# EasyEDA schematic Linkee.json
TITLE: Sheet_1; REV: 1.0; Date: 2023-06-07; Sheet: 1/1; Company: Your Company
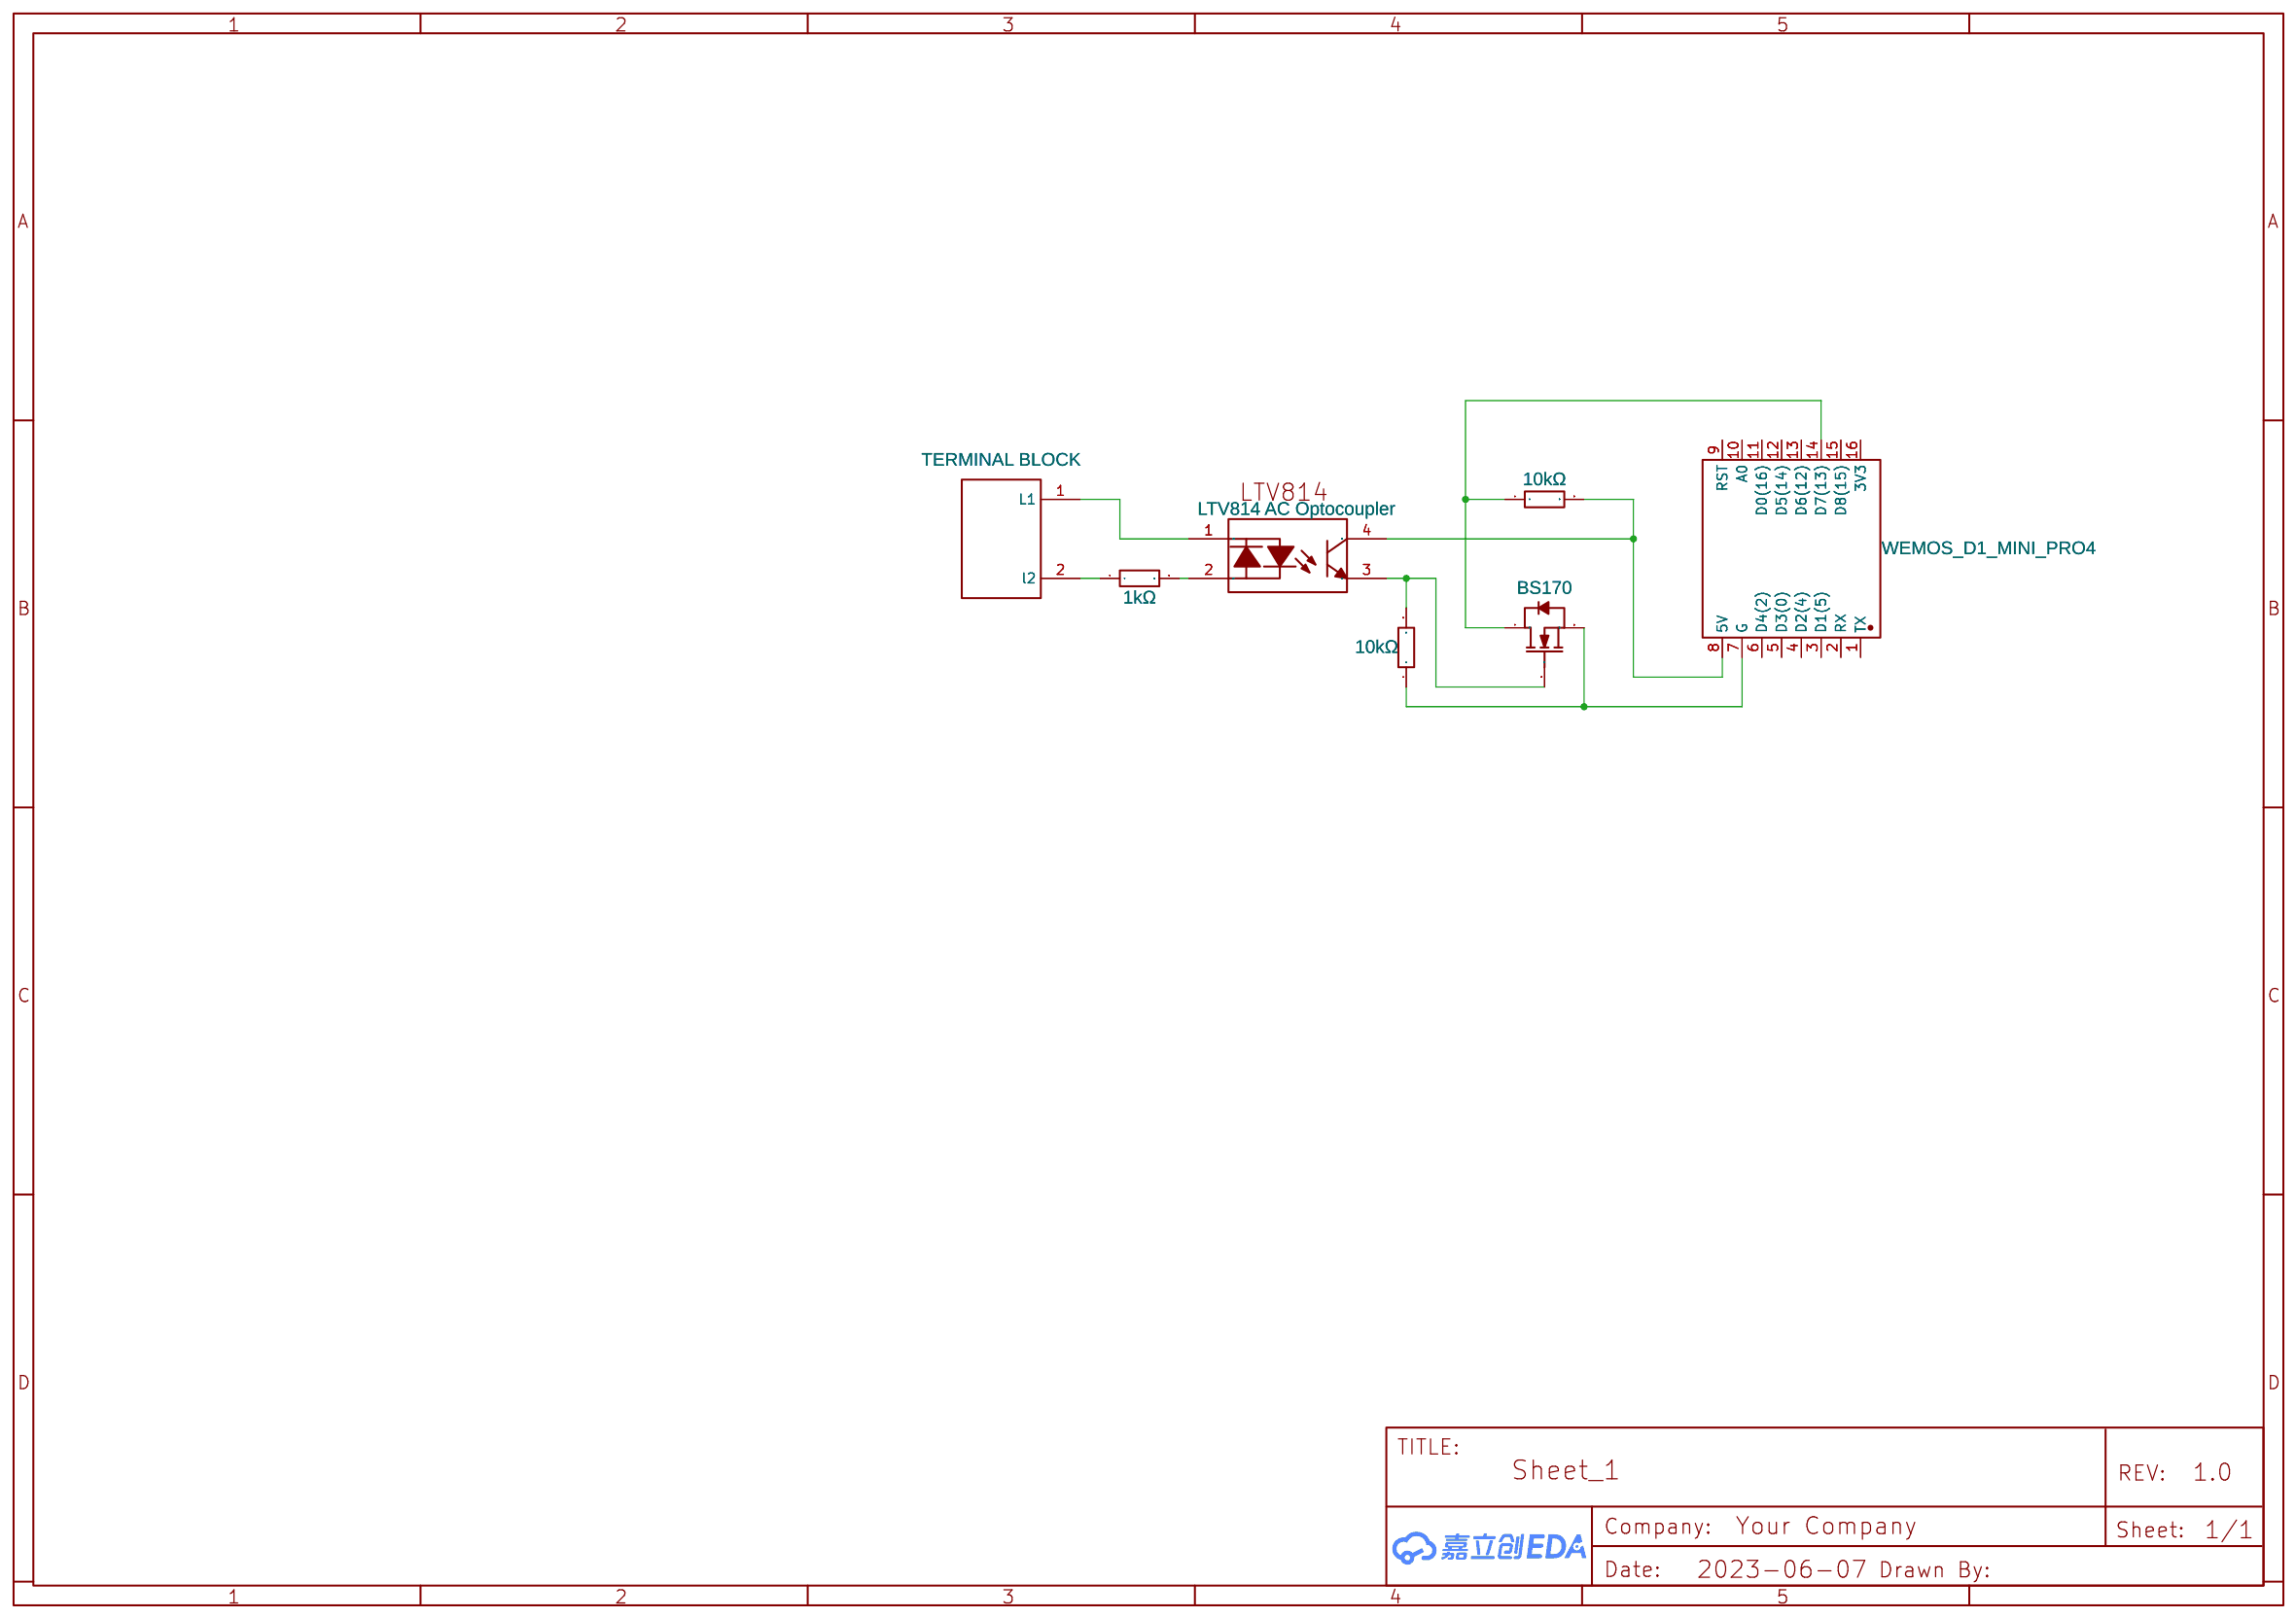
[diagram p0: schematic sheet]

## Parts
J1  TERMINAL BLOCK  [BORNIER2]
Q1  BS170  [TO-92-3_L4.9-W3.7-P1.27-L]
R1  1kΩ  [R0603]
R2  10kΩ  [R0603]
R3  10kΩ  [R0603]
U1  WEMOS_D1_MINI_PRO4  [DIP-16_WEMOS_D1_MINI_PRO4]
U2  LTV814 AC Optocoupler  [OPTO-SMD-4_L4.6-W6.5-P2.54-LS10.3-BL]

## Library data of the parts
J1 = Bornier2: Contributor: salydu29; sourceId: 5y8IiSrpn
Q1 = BS170: Supplier: LCSC; Manufacturer: onsemi(安森美); Supplier Part: C111691; JLCPCB Part Class: Extended Part
R1 = 0603WAF1001T5E: Supplier: LCSC; Manufacturer: UNI-ROYAL(厚声); Supplier Part: C21190; Resistance (Ohms): 1K; JLCPCB Part Class: Basic Part
R2 R3 = 0603WAF1002T5E: Supplier: LCSC; Manufacturer: UNI-ROYAL(厚声); Supplier Part: C25804; Resistance (Ohms): 10K; JLCPCB Part Class: Basic Part
U1 = WEMOS_D1_MINI_PRO4: Supplier: LCSC; Supplier Part: C2837266; Manufacturer: null; Manufacturer Part: Wemos_D1_mini_Pro4; Contributor: LCSC; JLCPCB Part Class: Extended Part
U2 = LTV814 AC Optocoupler: Supplier: LCSC; Manufacturer: VISHAY; Manufacturer Part: SFH6206-3T; Contributor: PoulErik; Supplier Part: LTV814; JLCPCB Part Class: Extended Part

## Nets
Net-(J1-1): J1.1(L1) U2.1(A/C)
Net-(J1-2): J1.2(l2) R1.1
Net-(Q1-1): Q1.1(D) R3.1 U1.14(D7(13))
Net-(Q1-2): Q1.2(G) R2.2 U2.3(EM)
Net-(Q1-3): Q1.3(S) R2.1 U1.7(G)
Net-(R1-2): R1.2 U2.2(C/A)
Net-(R3-2): R3.2 U1.8(5V) U2.4(COL)

Not connected (* = marked no-connect by the designer): U1 1(TX) 2(RX) 3(D1(5)) 4(D2(4)) 5(D3(0)) 6(D4(2)) 9(RST) 10(A0) 11(D0(16)) 12(D5(14)) 13(D6(12)) 15(D8(15)) 16(3V3)
